# EAGLE design main (EAGLE 7.6.0)
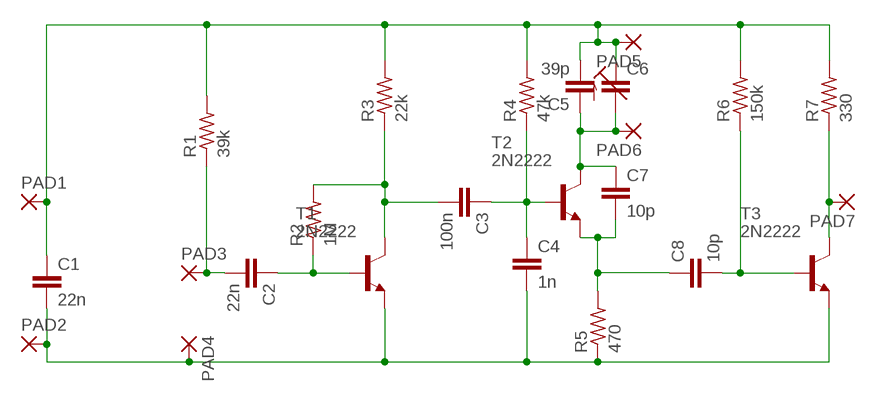
[diagram p0: schematic, sheet 1]

## Parts
C1  22n  C2.5/2  [C2.5-2]
C2  22n  C2.5/2  [C2.5-2]
C3  100n  C2.5/2  [C2.5-2]
C4  1n  C2.5/2  [C2.5-2]
C5  39p  C2.5/2  [C2.5-2]
C6  C-TRIMM3050.504  [CTRIM3050.504]
C7  10p  C2.5/2  [C2.5-2]
C8  10p  C2.5/2  [C2.5-2]
PAD1  2,54/0,8  [2,54/0,8]
PAD2  2,54/0,8  [2,54/0,8]
PAD3  2,54/0,8  [2,54/0,8]
PAD4  2,54/0,8  [2,54/0,8]
PAD5  2,54/0,8  [2,54/0,8]
PAD6  2,54/0,8  [2,54/0,8]
PAD7  2,54/0,8  [2,54/0,8]
R1  39k  R-US_0204/2V  [0204V]
R2  1M  R-US_0204/2V  [0204V]
R3  22k  R-US_0204/2V  [0204V]
R4  47k  R-US_0204/2V  [0204V]
R5  470  R-US_0204/2V  [0204V]
R6  150k  R-US_0204/2V  [0204V]
R7  330  R-US_0204/2V  [0204V]
T1  2N2222  [TO92-EBC-OVAL]
T2  2N2222  [TO92-EBC-OVAL]
T3  2N2222  [TO92-EBC-OVAL]

## Nets
A: C5.1 C6.2(A) C7.1 PAD6.1(P) T2.C
B: C2.2 PAD3.1(P) R1.1
C: C3.2 R2.2 R3.1 T1.C
D: C3.1 C4.1 R4.1 T2.B
E: C7.2 C8.1 R5.2 T2.E
F: PAD7.1(P) R7.1 T3.C
GND: C1.2 C4.2 PAD2.1(P) PAD4.1(P) R5.1 T1.E T3.E
N$1: C2.1 R2.1 T1.B
N$6: C8.2 R6.1 T3.B
V+: C1.1 C5.2 C6.1(E) PAD1.1(P) PAD5.1(P) R1.2 R3.2 R4.2 R6.2 R7.2

## Library data of the parts
C1-C5 C7 C8 = capacitor-wima:C: CAPACITOR naming: grid - package width
C6 = resistor:C-TRIMM: Trimm capacitor
PAD1-PAD7 = wirepad:2,54/0,8: THROUGH-HOLE PAD
R1-R7 = adafruit:R-US_: RESISTOR, American symbol
T1-T3 = adafruit:2N2222: NPN TRANSISTOR Big oval pads

## Board
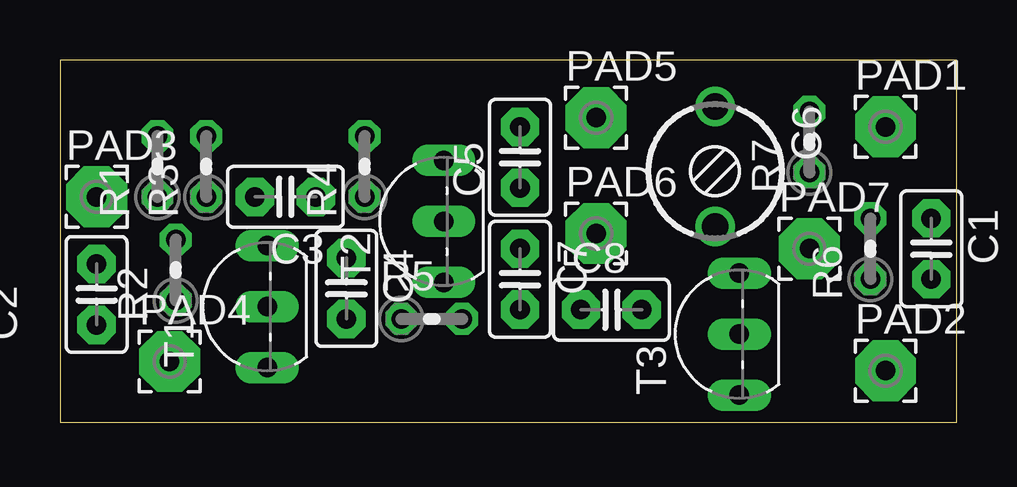
[diagram p1: board, top side]
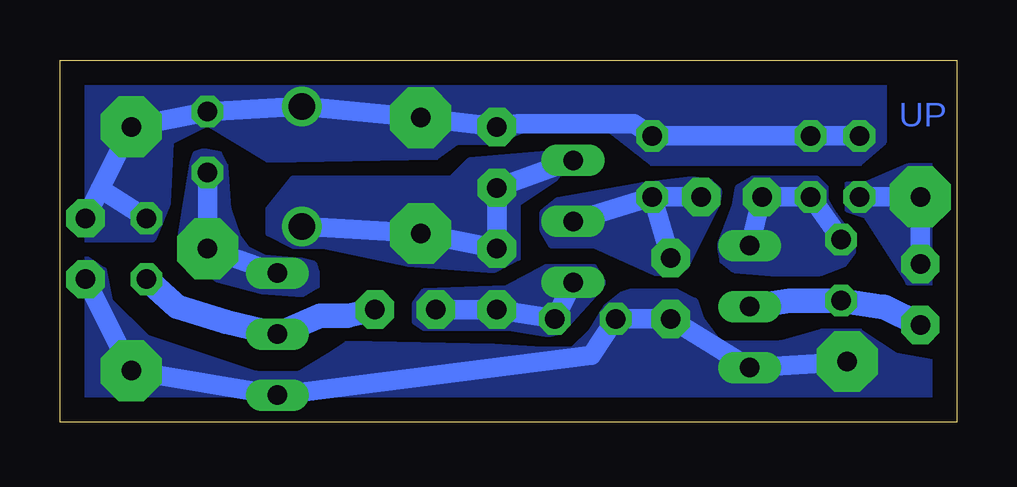
[diagram p2: board, bottom side, seen from below]

Size 37.39 x 15.1 mm. Coordinates in mm from the lower left corner, seen from the top.
Outline: 0,0 37.39,0 37.39,15.1 0,15.1 0,0
Copper layers (1*16): Top 0.035mm / dielectric 1.5mm / Bottom 0.035mm
Design rules "default": minimum track width 10mil, minimum drill 24mil, track to track 8mil, track to pad 8mil, pad to pad 8mil, via to via 8mil, smd to smd 8mil, copper to edge 40mil, drill to drill 8mil, minimum pad ring 10mil, minimum via ring 8mil, stop-mask expansion 4mil, vias tented up to drill 0mil, thermal gap 10mil

### Footprints (pad centres in the part's own frame; a part is rotated, then mirrored left to right if it is on the bottom)
C2.5-2 = drill 0.813 pad 1.6 octagon: 1 -1.27,0; 2 1.27,0
CTRIM3050.504 = drill 1.1: 1 -2.5,0; 2 2.5,0
2,54/0,8 = drill 0.813 pad 2.54 octagon: 1 0,0
0204V = drill 0.813 octagon: 1 -1.27,0; 2 1.27,0
TO92-EBC-OVAL = drill 0.813 long: B 0,-1.27; C 2.54,-1.27; E -2.54,-1.27

### Placement (x,y rotation side)
C1  36.32,7.24 270 top
C2  1.52,5.33 90 top
C3  9.4,9.4 180 top
C4  11.94,5.59 270 top
C5  19.18,11.05 90 top
C6  27.31,10.67 270 top
C7  19.18,5.97 270 top
C8  22.99,4.7 0 top
PAD1  34.42,12.32 0 top
PAD2  34.42,2.16 0 top
PAD3  1.52,9.4 0 top
PAD4  4.57,2.54 0 top
PAD5  22.35,12.7 0 top
PAD6  22.35,7.87 0 top
PAD7  31.24,7.24 0 top
R1  4.06,10.67 90 top
R2  4.83,6.35 90 top
R3  6.1,10.67 90 top
R4  12.7,10.67 90 top
R5  15.49,4.32 0 top
R6  33.78,7.24 90 top
R7  31.24,11.68 90 top
T1  7.37,4.83 90 top
T2  14.73,8.38 90 top
T3  27.05,3.68 90 top

### Tracks (layer width: path | path; a pad name or v marks a point on that pad's centre or on a via)
A
  Bottom 0.813: T2.C C5.1 C7.1 PAD6.1 C6.2
  pour Bottom (no thermals): 15.88,11.3 20.32,10.92 21.08,10.16 27.69,10.16 28.7,8.89 28.7,7.87 27.69,7.37 26.42,7.37 22.86,6.6 19.3,6.35 18.29,6.86 18.29,9.14 16.76,10.16
B
  Bottom 0.813: C2.2 PAD3.1 R1.1
  pour Bottom (no thermals): 1.52,5.84 -4.06,5.84 -4.06,10.41 -4.06,10.67 2.03,10.67 3.81,9.91 4.57,9.91 4.57,8.89 3.81,8.64 2.03,5.84
C
  Bottom 0.813: R2.2 R3.1 C3.2 T1.C
  pour Bottom (no thermals): 4.32,7.62 5.08,8.64 5.46,9.27 5.46,9.78 5.84,10.16 8.51,10.16 9.14,9.78 9.27,9.02 9.91,7.37 9.78,6.73 9.27,6.35 7.75,6.22 5.71,6.22 4.7,6.6 4.32,7.11
D
  Bottom 0.813: C3.1 R4.1 | C4.1 R4.1 | R4.1 T2.B
  pour Bottom (no thermals): 10.03,9.02 11.3,6.48 11.68,6.22 12.57,6.22 15.11,7.37 16.89,7.37 17.27,8 17.27,8.76 16.64,9.27 13.08,9.91 11.05,10.16 10.29,10.03 9.91,9.65
E
  Bottom 0.813: T2.E R5.2 C7.2 C8.1
  pour Bottom (no thermals): 15.11,6.48 17.14,6.48 18.8,5.59 22.23,5.46 22.61,4.95 22.61,4.19 22.23,3.94 18.67,3.94 17.02,3.68 16.51,3.81 15.11,5.33 14.73,5.84
F
  Bottom 0.813: R7.1 PAD7.1 T3.C
  pour Bottom (no thermals): 27.43,6.73 28.83,6.86 29.59,7.24 29.97,7.75 30.35,8.89 30.48,10.67 30.73,11.18 31.37,11.3 31.75,11.18 31.88,10.79 32.39,7.75 31.11,6.22 30.86,5.97 28.96,5.46 27.31,5.33 26.67,5.71 26.67,6.22 26.8,6.6 27.31,6.73
GND
  Bottom 0.813: PAD4.1 T1.E C4.2 R5.1 15.24,2.79 T3.E PAD2.1 C1.2
  pour Bottom (no thermals): 36.32,6.86 35.56,6.35 35.31,5.08 33.78,3.56 29.21,2.03 27.43,2.03 26.16,2.79 25.4,3.3 19.3,3.17 17.27,3.05 16,3.05 15.24,3.81 14.61,4.83 13.97,5.33 13.59,5.46 11.68,5.46 10.92,5.08 10.67,4.32 9.91,3.3 7.37,3.3 5.59,3.81 4.06,3.81 2.54,2.79 1.02,2.54 1.02,-1.02 37.85,-1.02 37.85,6.86
N$1
  Bottom 1.016: C2.1 3.05,4.83 3.18,4.83 R2.1 6.98,5.08 T1.B
N$6
  Bottom 1.016: C8.2 25.4,4.45 26.54,4.45 T3.B 30.48,4.19 32.51,4.83 R6.1
V+
  Bottom 0.813: R1.2 R3.2 R4.2 13.46,12.45 18.29,12.45 C5.2 PAD5.1 C6.1 R7.2 PAD1.1 35.71,9.73 | C1.1 35.71,9.73 | R6.2 35.71,9.73
  pour Bottom (no thermals): 4.06,10.79 12.7,10.79 14.48,12.19 18.03,12.19 19.3,11.68 20.83,11.68 21.72,11.05 28.7,10.92 31.24,12.45 32.77,11.68 32.89,9.14 33.53,7.62 36.83,7.62 37.08,8.13 37.08,14.22 3.05,14.22 3.05,11.68

### Text on the board
Bottom: UP